# Altium project JSP014RC.PrjPCB
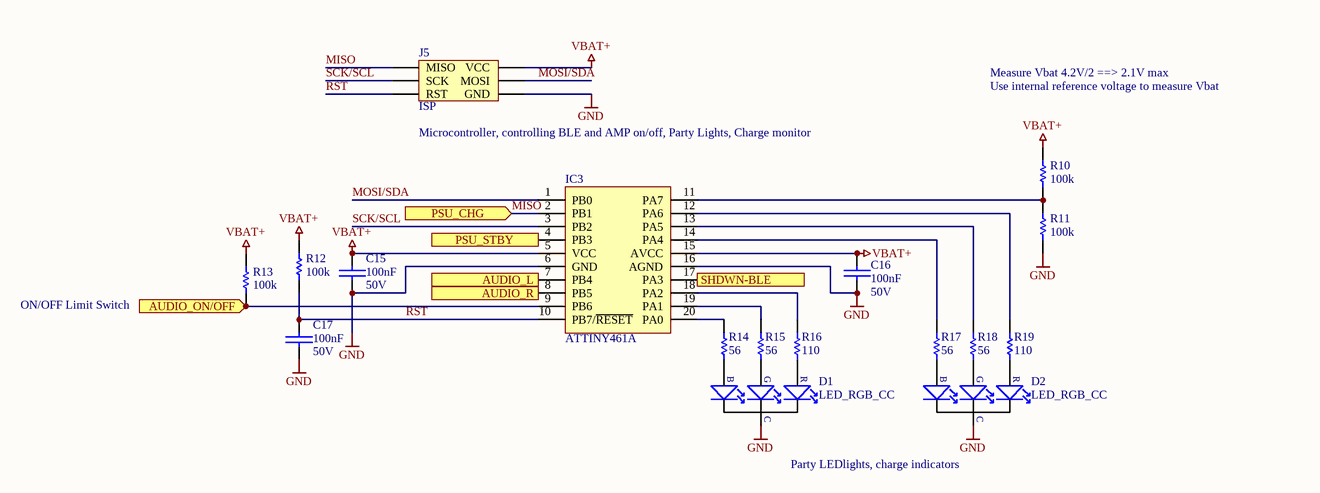
[diagram p0: MCU.SchDoc]
3 sheets, 72 parts. Net scope: flat (ports and power ports of the same name join across sheets).
Board file: JSP014RC.PcbDoc
Sheets:
  MCU.SchDoc
  AUDIO.SchDoc
  PSU.SchDoc

## Sheet MCU.SchDoc
size A4

### Parts
C15  value 100nF  voltage: 50V  [TH5.08]  (hidden comment: cap_non_pol)
C16  value 100nF  voltage: 50V  [TH5.08]  (hidden comment: cap_non_pol)
C17  value 100nF  voltage: 50V  [TH5.08]  (hidden comment: cap_non_pol)
D1  LED_RGB_CC  [5MM-RGB-CC]
D2  LED_RGB_CC  [5MM-RGB-CC]
IC3  ATTINY461A  [PDIP-20]
J5  ISP  [ISP_COMPACT]
R10  value 100k  [TH6.3]  (hidden comment: resistor)
R11  value 100k  [TH6.3]  (hidden comment: resistor)
R12  value 100k  [TH6.3]  (hidden comment: resistor)
R13  value 100k  [TH6.3]  (hidden comment: resistor)
R14  value 56  [TH6.3]  (hidden comment: resistor)
R15  value 56  [TH6.3]  (hidden comment: resistor)
R16  value 110  [TH6.3]  (hidden comment: resistor)
R17  value 56  [TH6.3]  (hidden comment: resistor)
R18  value 56  [TH6.3]  (hidden comment: resistor)
R19  value 110  [TH6.3]  (hidden comment: resistor)

### Ports
AUDIO_L (in), AUDIO_ON/OFF (in), AUDIO_R (in), PSU_CHG (in), PSU_STBY (in), SHDWN-BLE (out)

### Nets
GND: C15.2 C16.2 C17.2 D1.C D2.C IC3.6(GND) IC3.16(AGND) J5.GND R11.1
VBAT+: C15.1 C16.1 IC3.5(VCC) IC3.15(AVCC) J5.VCC R10.2 R12.2 R13.2
MISO: IC3.2(PB1) J5.MISO ; port PSU_CHG
MOSI/SDA: IC3.1(PB0) J5.MOSI
RST: C17.1 IC3.10(PB7/~{RESET}) J5.RST R12.1
SCK/SCL: IC3.3(PB2) J5.SCK
SHDWN-BLE: IC3.17(PA3) ; port SHDWN-BLE
NetC18_1: IC3.7(PB4) ; port AUDIO_L
NetC19_1: IC3.8(PB5) ; port AUDIO_R
NetD1_B: D1.B R14.2
NetD1_G: D1.G R15.2
NetD1_R: D1.R R16.2
NetD2_B: D2.B R17.2
NetD2_G: D2.G R18.2
NetD2_R: D2.R R19.2
NetIC3_4: IC3.4(PB3) ; port PSU_STBY
NetIC3_9: IC3.9(PB6) R13.1 ; port AUDIO_ON/OFF
NetIC3_11: IC3.11(PA7) R10.1 R11.2
NetIC3_12: IC3.12(PA6) R19.1
NetIC3_13: IC3.13(PA5) R18.1
NetIC3_14: IC3.14(PA4) R17.1
NetIC3_18: IC3.18(PA2) R16.1
NetIC3_19: IC3.19(PA1) R15.1
NetIC3_20: IC3.20(PA0) R14.1

### Notes on the sheet
- (near J5) Microcontroller, controlling BLE and AMP on/off, Party Lights, Charge monitor
- Measure Vbat 4.2V/2 ==> 2.1V max
- Use internal reference voltage to measure Vbat
- ON/OFF Limit Switch
- Party LEDlights, charge indicators

### Library data of the parts
C15-C17 = 37: CAP CER TH 100nF X7R 50V; manufacturer_ref: C2761753; manufacturer: FH; id: 37; tolerance: 10%; dielectric: X7R; package: TH5.08; supplier_1: lcsc; supplier_1_partnumber: C385200; price: 0,0237; status: active
D1 D2 = 5: LED (RGB); manufacturer_ref: TJ-L5FCMXHTCSLCRGB-A5; manufacturer: TOGIALED; id: 5; type: LED (RGB); package: 5MM; supplier_1: lcsc; supplier_1_partnumber: C2837020; price: 0,1194; status: active
IC3 = 56: IC MCU 8BIT 4KB FLASH 20DIP; manufacturer_ref: ATTINY461A-PU; manufacturer: Microchip Technology; id: 56; type: Microcontroller; package: 20-PDIP; supplier_1: digikey; supplier_1_partnumber: ATTINY461A-PU-ND, 2057-ICS-320-T-ND; price: 1,91; status: active
J5 = 35: CONN 6 PIN SOLDER PADS FOR ISP; manufacturer_ref: ISP COMPACT; id: 35; nbr_positions_total: 6; package: Pin-6DR; price: 0; status: active
R10-R13 = 56: RES TH 100k OHM 5% 1/4W; manufacturer_ref: CR1/4W-100K±5%-RT52; manufacturer: VO; id: 56; tolerance: 5%; power: 1/4W; package: TH6.3; supplier_1: lcsc; supplier_1_partnumber: C2894520; price: 0,0038; status: active
R14 R15 R17 R18 = 61: RES TH 56 OHM 5% 1/8W; manufacturer_ref: CR1/4W-56Ω±5%-OT52; manufacturer: VO; id: 61; tolerance: 5%; power: 1/8W; package: TH6.3; supplier_1: lcsc; supplier_1_partnumber: C2896859; price: 0,0039; status: active
R16 R19 = 60: RES TH 110 OHM 1% 1/8W; manufacturer_ref: MF1/8W-110Ω±1%T52; manufacturer: Huaxing Mechanical-Elec.; id: 60; tolerance: 1%; power: 1/8W; package: TH6.3; supplier_1: lcsc; supplier_1_partnumber: C713899; price: 0,0053; status: active

## Sheet AUDIO.SchDoc
size A4
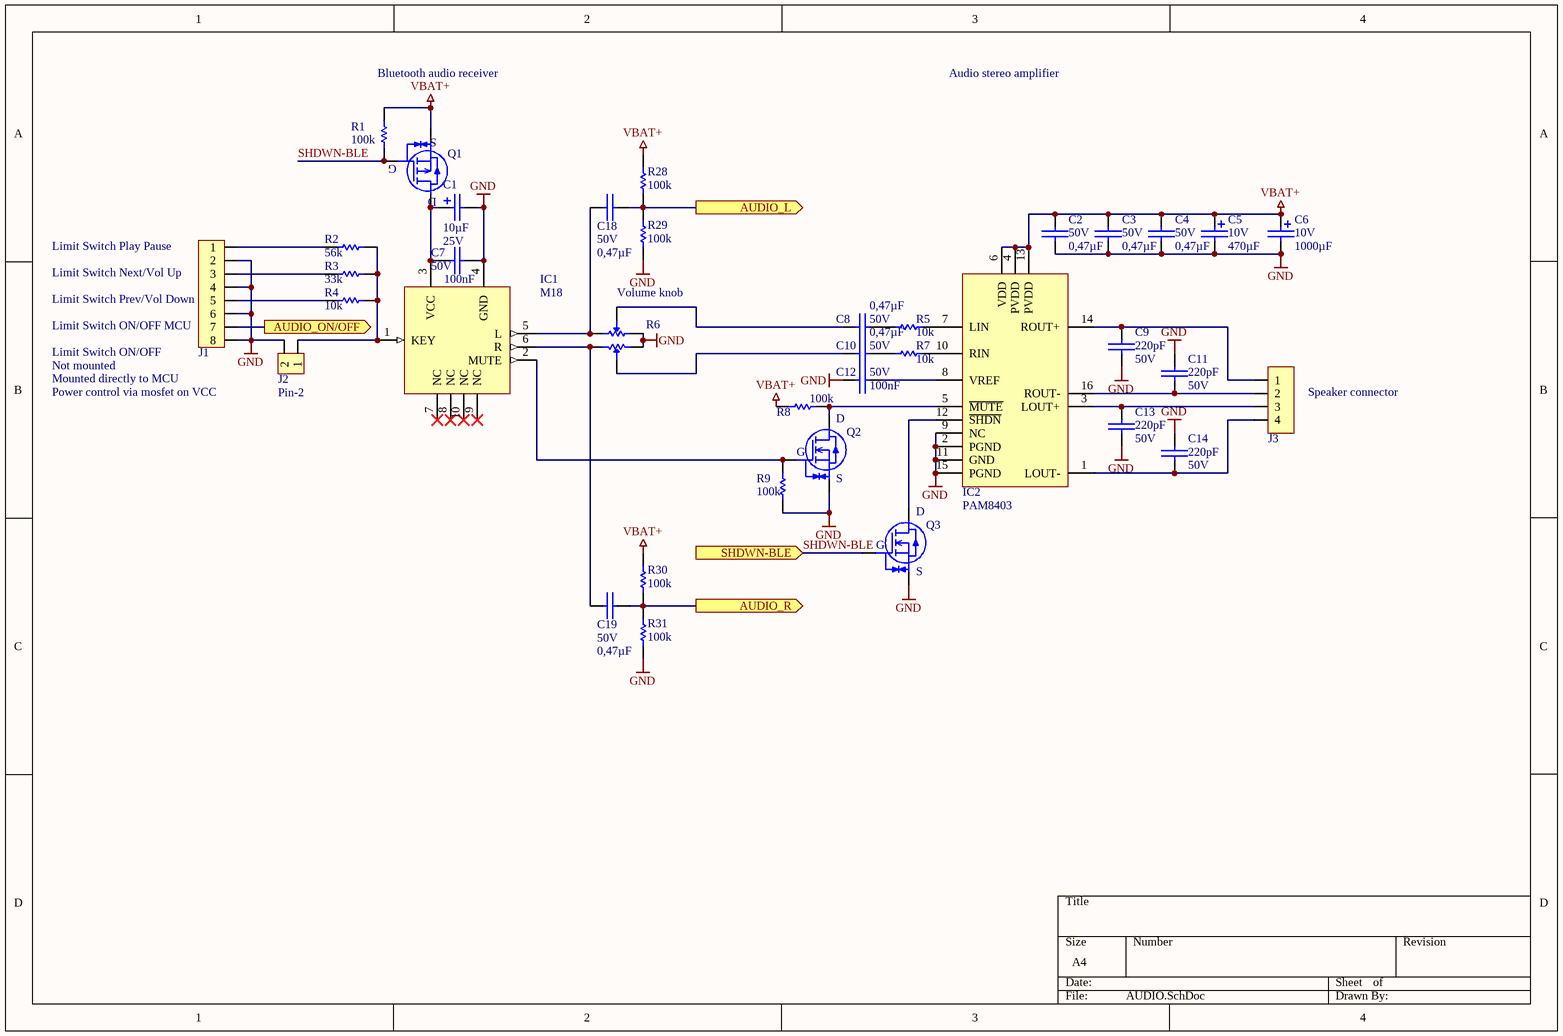
[diagram p1: AUDIO.SchDoc]

### Parts
C1  value 10µF  voltage: 25V  [CD6.3H12TH]  (hidden comment: cap-pol)
C2  value 0,47µF  voltage: 50V  [TH5.08]  (hidden comment: cap_non_pol)
C3  value 0,47µF  voltage: 50V  [TH5.08]  (hidden comment: cap_non_pol)
C4  value 0,47µF  voltage: 50V  [TH5.08]  (hidden comment: cap_non_pol)
C5  value 470µF  voltage: 10V  [CD6.3H12TH]  (hidden comment: cap-pol)
C6  value 1000µF  voltage: 10V  [CD8H12TH]  (hidden comment: cap-pol)
C7  value 100nF  voltage: 50V  [TH5.08]  (hidden comment: cap_non_pol)
C8  value 0,47µF  voltage: 50V  [TH5.08]  (hidden comment: cap_non_pol)
C9  value 220pF  voltage: 50V  [TH5.08]  (hidden comment: cap_non_pol)
C10  value 0,47µF  voltage: 50V  [TH5.08]  (hidden comment: cap_non_pol)
C11  value 220pF  voltage: 50V  [TH5.08]  (hidden comment: cap_non_pol)
C12  value 100nF  voltage: 50V  [TH5.08]  (hidden comment: cap_non_pol)
C13  value 220pF  voltage: 50V  [TH5.08]  (hidden comment: cap_non_pol)
C14  value 220pF  voltage: 50V  [TH5.08]  (hidden comment: cap_non_pol)
C18  value 0,47µF  voltage: 50V  [TH5.08]  (hidden comment: cap_non_pol)
C19  value 0,47µF  voltage: 50V  [TH5.08]  (hidden comment: cap_non_pol)
IC1  M18  [M18]
IC2  PAM8403  [SOIC-16]
J1  Pin-8  [2205114-3]  (value not drawn)
J2  Pin-2  [2-PIN]
J3  Pin-4  [B4B-PH-K]  (value not drawn)
Q1  P_CH_MOSFET2  [TO-220AB]  (value not drawn)
Q2  N_CH_MOSFET2  [TO-92]  (value not drawn)
Q3  N_CH_MOSFET2  [TO-92]  (value not drawn)
R1  value 100k  [TH6.3]  (hidden comment: resistor)
R2  value 56k  [TH6.3]  (hidden comment: resistor)
R3  value 33k  [TH6.3]  (hidden comment: resistor)
R4  value 10k  [TH6.3]  (hidden comment: resistor)
R5  value 10k  [TH6.3]  (hidden comment: resistor)
R6  2-gang potentiometer  [P140KV1-F25BR10K]  (value not drawn)
R7  value 10k  [TH6.3]  (hidden comment: resistor)
R8  value 100k  [TH6.3]  (hidden comment: resistor)
R9  value 100k  [TH6.3]  (hidden comment: resistor)
R28  value 100k  [TH6.3]  (hidden comment: resistor)
R29  value 100k  [TH6.3]  (hidden comment: resistor)
R30  value 100k  [TH6.3]  (hidden comment: resistor)
R31  value 100k  [TH6.3]  (hidden comment: resistor)

### Ports
AUDIO_L (out), AUDIO_ON/OFF (out), AUDIO_R (out), SHDWN-BLE (in)

### Nets
GND: C1.- C2.2 C3.2 C4.2 C5.- C6.- C7.2 C9.2 C11.1 C12.2 C13.2 C14.1 IC1.4(GND) IC2.2(PGND) IC2.9(NC) IC2.11(GND) IC2.15(PGND) J1.2 J1.4 J1.6 J1.8 J2.2 Q2.S Q3.S R6.1 R6.2 R9.1 R29.1 R31.1
VBAT+: C2.1 C3.1 C4.1 C5.+ C6.+ IC2.4(PVDD) IC2.6(VDD) IC2.13(PVDD) Q1.S R1.2 R8.1 R28.2 R30.2
SHDWN-BLE: Q1.G Q3.G R1.1 ; port SHDWN-BLE
NetC1_+: C1.+ C7.1 IC1.3(VCC) Q1.D
NetC8_1: C8.1 R5.2
NetC8_2: C8.2 R6.4
NetC9_1: C9.1 IC2.14(ROUT+) J3.1
NetC10_1: C10.1 R7.2
NetC10_2: C10.2 R6.3
NetC11_2: C11.2 IC2.16(ROUT-) J3.2
NetC12_1: C12.1 IC2.8(VREF)
NetC13_1: C13.1 IC2.3(LOUT+) J3.3
NetC14_2: C14.2 IC2.1(LOUT-) J3.4
NetC18_1: C18.1 R28.1 R29.2 ; port AUDIO_L
NetC18_2: C18.2 IC1.5(L) R6.6
NetC19_1: C19.1 R30.1 R31.2 ; port AUDIO_R
NetC19_2: C19.2 IC1.6(R) R6.5
NetIC1_1: IC1.1(KEY) J2.1 R2.1 R3.1 R4.1
NetIC1_2: IC1.2(MUTE) Q2.G R9.2
NetIC2_5: IC2.5(~{MUTE}) Q2.D R8.2
NetIC2_7: IC2.7(LIN) R5.1
NetIC2_10: IC2.10(RIN) R7.1
NetIC2_12: IC2.12(~{SHDN}) Q3.D
NetIC3_9: J1.7 ; port AUDIO_ON/OFF
NetJ1_1: J1.1 R2.2
NetJ1_3: J1.3 R3.2
NetJ1_5: J1.5 R4.2

Not connected (* = marked no-connect by the designer): IC1 7(NC)* 8(NC)* 9(NC)* 10(NC)*

### Notes on the sheet
- Bluetooth audio receiver
- Audio stereo amplifier
- (near J1) Limit Switch Play Pause
- (near J1) Limit Switch Next/Vol Up
- (near J1) Limit Switch Prev/Vol Down
- (near R6) Volume knob
- Not mounted
- Limit Switch ON/OFF
- (near J1) Mounted directly to MCU
- (near J1) Limit Switch ON/OFF MCU
- Power control via mosfet on VCC
- (near J3) Speaker connector

### Library data of the parts
C1 = 4: CAP ALUM 10UF 20% 25V TH; manufacturer_ref: ECF1KM100E12OTPO; manufacturer: Yunxing; id: 4; dielectric: Aluminium; tolerance: 20%; package: d6,3h12TH; supplier_1: lcsc; supplier_1_partnumber: C2841587; price: 0,0229; status: active
C2-C4 C8 C10 C18 C19 = 36: CAP CER TH 0.47µF X7R 50V; manufacturer_ref: C2761753; manufacturer: Dersonic; id: 36; tolerance: 10%; dielectric: X7R; package: TH5.08; supplier_1: lcsc; supplier_1_partnumber: C2761753; price: 0,0536; status: active
C5 = 2: CAP ALUM 470UF 20% 10V TH; manufacturer_ref: EGH1AM471E12OT; manufacturer: AISHI(Aihua Group); id: 2; dielectric: Aluminium; tolerance: 20%; package: d6.3h12TH; supplier_1: lcsc; supplier_1_partnumber: C2924460; price: 0,0391; status: active
C6 = 3: CAP ALUM 1000UF 20% 10V TH; manufacturer_ref: EWH1AM102F120T; manufacturer: AISHI(Aihua Group); id: 3; dielectric: Aluminium; tolerance: 20%; package: d8h12TH; supplier_1: lcsc; supplier_1_partnumber: C105310; price: 0,0464; status: active
C7 C12 = 37: as C15 on sheet MCU; dielectric: X7R; package: TH5.08; supplier_1: lcsc; supplier_1_partnumber: C385200; price: 0,0237; status: active
C9 C11 C13 C14 = 38: CAP CER TH 100nF X7R 50V; manufacturer_ref: C2761753; manufacturer: WMEC; id: 38; tolerance: 10%; dielectric: X7R; package: TH5.08; supplier_1: lcsc; supplier_1_partnumber: C2905888; price: 0,0237; status: active
IC1 = 55: M18 Bluetooth 4.2 Audio-receiver Module Lossless; manufacturer_ref: MH-M18; id: 55; type: Wireless (Bluetooth Audio); package: M18; supplier_1: banggood; supplier_1_partnumber: 1527332; price: 2,5; status: active
IC2 = 54: 3W x 2 RL=4Ω 2.5V ~ 5.5V (stereo) Class D SOIC-16 Audio Power OpAmps; manufacturer_ref: PAM8403DR-H; manufacturer: Diodes Incorporated; id: 54; type: Analog (Stereo Amp); package: 16-SOIC; supplier_1: lcsc; supplier_1_partnumber: C17337; price: 0,5806; status: active
J1 = 31: CA 200MM 08 POS. MOW-PB M-M VALU; manufacturer: TE Connectivity AMP Connectors; id: 31; nbr_positions_total: 8; manufacturer_ref: 2205114-3; package: Pin-8DR; supplier_1: digikey; supplier_1_partnumber: A123436-ND; price: 2,29; status: active
J2 = 18: 'CONN 2 PIN SOLDER PADS; manufacturer_ref: TH-2; id: 18; nbr_positions_total: 2; package: Pin-2SR; price: 0; status: active
J3 = 32: CONN HEADER VERT 4POS 2MM; manufacturer_ref: B4B-PH-K(LF)(SN); manufacturer: JST Sales America Inc.; id: 32; nbr_positions_total: 4; package: Pin-4SR; supplier_1: digikey; supplier_1_partnumber: B4B-PH-K(LF)(SN)-ND; price: 0,23; status: active
Q1 = 12: MOSFET P-CH 60V 17A TO-220AB; manufacturer_ref: HSP6113; manufacturer: HUASHUO; id: 12; voltage_vgs_min: -2.5V; type: P channel; current_rating: 17A; voltage_vds: 60V; package: TO-220AB; supplier_1: lcsc; supplier_1_partnumber: C2903571; price: 0,4184; status: active
Q2 Q3 = 13: MOSFET N-CH 60V 0.2A TO-92; manufacturer_ref: 2N7000; manufacturer: Changjiang Electronics Tech (CJ); id: 13; voltage_vgs_min: 3v; type: N channel; current_rating: 0.2A; voltage_vds: 60V; package: TO-92; supplier_1: lcsc; supplier_1_partnumber: C9114; price: 0,0417; status: active
R1 R8 R9 R28-R31 = 56: as R10 on sheet MCU; tolerance: 5%; power: 1/4W; package: TH6.3; supplier_1: lcsc; supplier_1_partnumber: C2894520; price: 0,0038; status: active
R2 = 54: RES TH 56k OHM 5% 1/4W; manufacturer_ref: CR1/4W-56K±5%-OT26; manufacturer: VO; id: 54; tolerance: 5%; power: 1/4W; package: TH6.3; supplier_1: lcsc; supplier_1_partnumber: C2896856; price: 0,0038; status: active
R3 = 53: RES TH 33k OHM 5% 1/4W; manufacturer_ref: CR1/4W-33K±5%-OT26; manufacturer: VO; id: 53; tolerance: 5%; power: 1/4W; package: TH6.3; supplier_1: lcsc; supplier_1_partnumber: C2894551; price: 0,0038; status: active
R4 R5 R7 = 52: RES TH 10k OHM 5% 1/4W; manufacturer_ref: CR1/4W-10K±5%-OT26; manufacturer: VO; id: 52; tolerance: 5%; power: 1/4W; package: TH6.3; supplier_1: lcsc; supplier_1_partnumber: C2894537; price: 0,0038; status: active
R6 = 3: POT 10K OHM 1/20W PLASTIC LINEAR; manufacturer: TT Electronics/BI; id: 3; manufacturer_ref: P140KV1-F25BR10K; value: 10k; power: 1/20W; type: 2-GANG POTENTIOMETER; package: P140KV1-F25BR10K; supplier_1: digikey; supplier_1_partnumber: 987-1296-ND; price: 0,97; status: active

## Sheet PSU.SchDoc
size A4
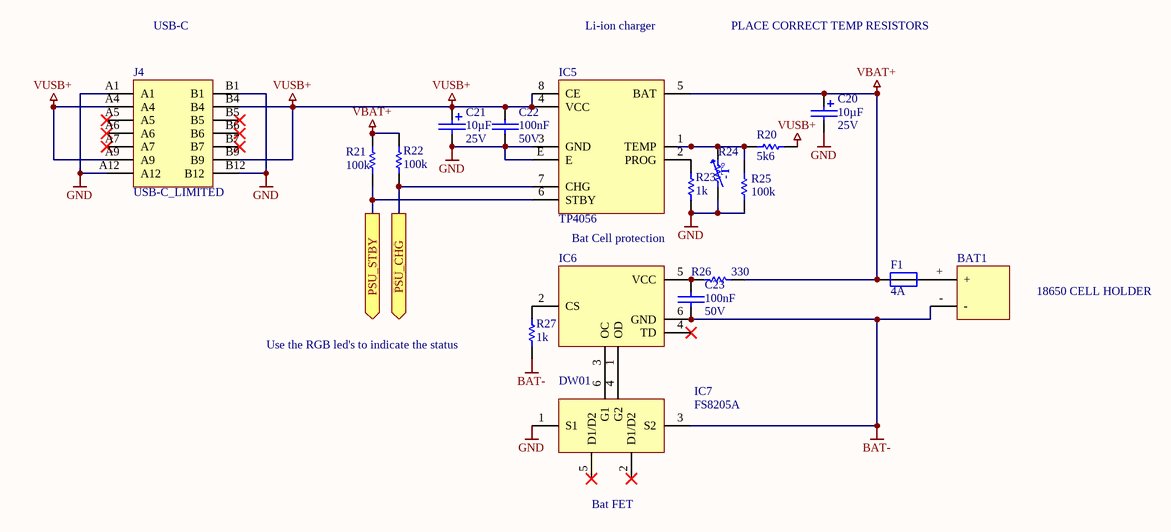
[diagram p2: PSU.SchDoc]

### Parts
BAT1  18650 CELL HOLDER  [T353]
C20  value 10µF  voltage: 25V  [CD6.3H12TH]  (hidden comment: cap-pol)
C21  value 10µF  voltage: 25V  [CD6.3H12TH]  (hidden comment: cap-pol)
C22  value 100nF  voltage: 50V  [TH5.08]  (hidden comment: cap_non_pol)
C23  value 100nF  voltage: 50V  [TH5.08]  (hidden comment: cap_non_pol)
F1  value 4A  [F0603]  (hidden comment: fuse)
IC5  TP4056
IC6  DW01  [SOT-23-6]
IC7  FS8205A  [SOT-23-6]
J4  USB-C_LIMITED  [GT-USB-7037]
R20  value 5k6  [TH6.3]  (hidden comment: resistor)
R21  value 100k  [TH6.3]  (hidden comment: resistor)
R22  value 100k  [TH6.3]  (hidden comment: resistor)
R23  value 1k  [TH6.3]  (hidden comment: resistor)
R24  thermistor  [TH6.3]  (value not drawn)
R25  value 100k  [TH6.3]  (hidden comment: resistor)
R26  value 330  [TH6.3]  (hidden comment: resistor)
R27  value 1k  [TH6.3]  (hidden comment: resistor)

### Ports
PSU_CHG (out), PSU_STBY (out)

### Nets
BAT-: BAT1.- C23.2 IC6.6(GND) IC7.3(S2) R27.2
GND: C20.- C21.- C22.2 IC5.3(GND) IC5.E IC7.1(S1) J4.A1 J4.A12 J4.B1 J4.B12 R23.2 R24.1 R25.1
VBAT+: C20.+ F1.1 IC5.5(BAT) R21.2 R22.1 R26.2
VUSB+: C21.+ C22.1 IC5.4(VCC) IC5.8(CE) J4.A4 J4.A9 J4.B4 J4.B9 R20.2
MISO: IC5.7(CHG) R22.2 ; port PSU_CHG
NetBAT1_+: BAT1.+ F1.2
NetC23_1: C23.1 IC6.5(VCC) R26.1
NetIC3_4: IC5.6(STBY) R21.1 ; port PSU_STBY
NetIC5_1: IC5.1(TEMP) R20.1 R24.2 R25.2
NetIC5_2: IC5.2(PROG) R23.1
NetIC6_1: IC6.1(OD) IC7.4(G2)
NetIC6_2: IC6.2(CS) R27.1
NetIC6_3: IC6.3(OC) IC7.6(G1)

Not connected (* = marked no-connect by the designer): IC6 4(TD)*; IC7 2(D1/D2)* 5(D1/D2)*; J4 A5* A6* A7* B5* B6* B7*

### Notes on the sheet
- USB-C
- Li-ion charger
- PLACE CORRECT TEMP RESISTORS
- Bat Cell protection
- (near R27) Use the RGB led's to indicate the status
- (near IC7) Bat FET
- (in symbol 4) -T°

### Library data of the parts
BAT1 = 12: 18650 single cell Battery holder; manufacturer: GTIWUNG; id: 12; manufacturer_ref: T353; type: Battery holder; package: T353; supplier_1: amazon; supplier_1_partnumber: B08CY56M98; price: 0,99; status: active
C20 C21 = 4: as C1 on sheet AUDIO; tolerance: 20%; package: d6,3h12TH; supplier_1: lcsc; supplier_1_partnumber: C2841587; price: 0,0229; status: active
C22 C23 = 37: as C15 on sheet MCU; dielectric: X7R; package: TH5.08; supplier_1: lcsc; supplier_1_partnumber: C385200; price: 0,0237; status: active
F1 = 8: FUSE BOARD MOUNT 4A 32VDC 0603; manufacturer_ref: MFU0603FF04000P500; manufacturer: Vishay Beyschlag/Draloric/BC Components; id: 8; response_time: FAST; package: 0603; supplier_1: digikey; supplier_1_partnumber: 749-MFU0603FF04000P500CT-ND; price: 0,22; status: active
IC6 = 59: IC  Battery Management IC; manufacturer_ref: DW01+G; manufacturer: Fortune Semicon; id: 59; type: PMIC (Battery Management); package: SOT-23-6; supplier_1: lcsc; supplier_1_partnumber: C14213; price: 0,153; status: active
IC7 = 60: IC  MOSFET Array 3A; manufacturer: TECH PUBLIC; id: 60; manufacturer_ref: FS8205A; type: MOSFET ARRAY; package: SOT-23-6; supplier_1: lcsc; supplier_1_partnumber: C2830320; price: 0,06; status: active
J4 = 30: USB TYPE C , RECEPTACLE, R/A; manufacturer: G-Switch; id: 30; nbr_positions_total: 14; manufacturer_ref: GT-USB-7037; package: USB-C_LIMITED; supplier_1: lcsc; supplier_1_partnumber: C2762981; price: 0,4797; status: active
R20 = 64: RES TH 4k12 OHM 1% 1/4W; manufacturer_ref: MFR0W4F5601A50; manufacturer: UNI-ROYAL(Uniroyal Elec); id: 64; tolerance: 0,01; power: 1/4W; package: TH6,3; supplier_1: lcsc; supplier_1_partnumber: C58603; price: 0,02; status: active
R21 R22 R25 = 56: as R10 on sheet MCU; tolerance: 5%; power: 1/4W; package: TH6.3; supplier_1: lcsc; supplier_1_partnumber: C2894520; price: 0,0038; status: active
R23 R27 = 57: RES TH 1k OHM 5% 1/4W; manufacturer_ref: CR1/4W-1K±5%-OT52; manufacturer: VO; id: 57; tolerance: 5%; power: 1/4W; package: TH6.3; supplier_1: lcsc; supplier_1_partnumber: C2894570; price: 0,0038; status: active
R24 = 4: THERMISTOR NTC 10KOHM 3435K BEAD; manufacturer_ref: MF58 103J3435; manufacturer: Nanjing Shiheng Elec; id: 4; value: 10k; tolerance: 5%; power: 1/20W; type: NTC_THERMISTOR; package: TH6.3; supplier_1: lcsc; supplier_1_partnumber: C123389; price: 0,0059; status: active
R26 = 58: RES TH 330 OHM 5% 1/4W; manufacturer_ref: CR1/4W-330Ω±5%-OT52; manufacturer: VO; id: 58; tolerance: 5%; power: 1/4W; package: TH6.3; supplier_1: lcsc; supplier_1_partnumber: C2894590; price: 0,0041; status: active

## Nets that join several sheets
GND: MCU (9 pins), AUDIO (29 pins), PSU (13 pins)
VBAT+: MCU (8 pins), AUDIO (13 pins), PSU (6 pins)
MISO: MCU (IC3.2 J5.MISO), PSU (IC5.7 R22.2)
NetC18_1: MCU (IC3.7), AUDIO (C18.1 R28.1 R29.2)
NetC19_1: MCU (IC3.8), AUDIO (C19.1 R30.1 R31.2)
NetIC3_4: MCU (IC3.4), PSU (IC5.6 R21.1)
NetIC3_9: MCU (IC3.9 R13.1), AUDIO (J1.7)
SHDWN-BLE: MCU (IC3.17), AUDIO (Q1.G Q3.G R1.1)